# EAGLE schematic キッカー (EAGLE 9.6.2)

## Sheet 1 of 2
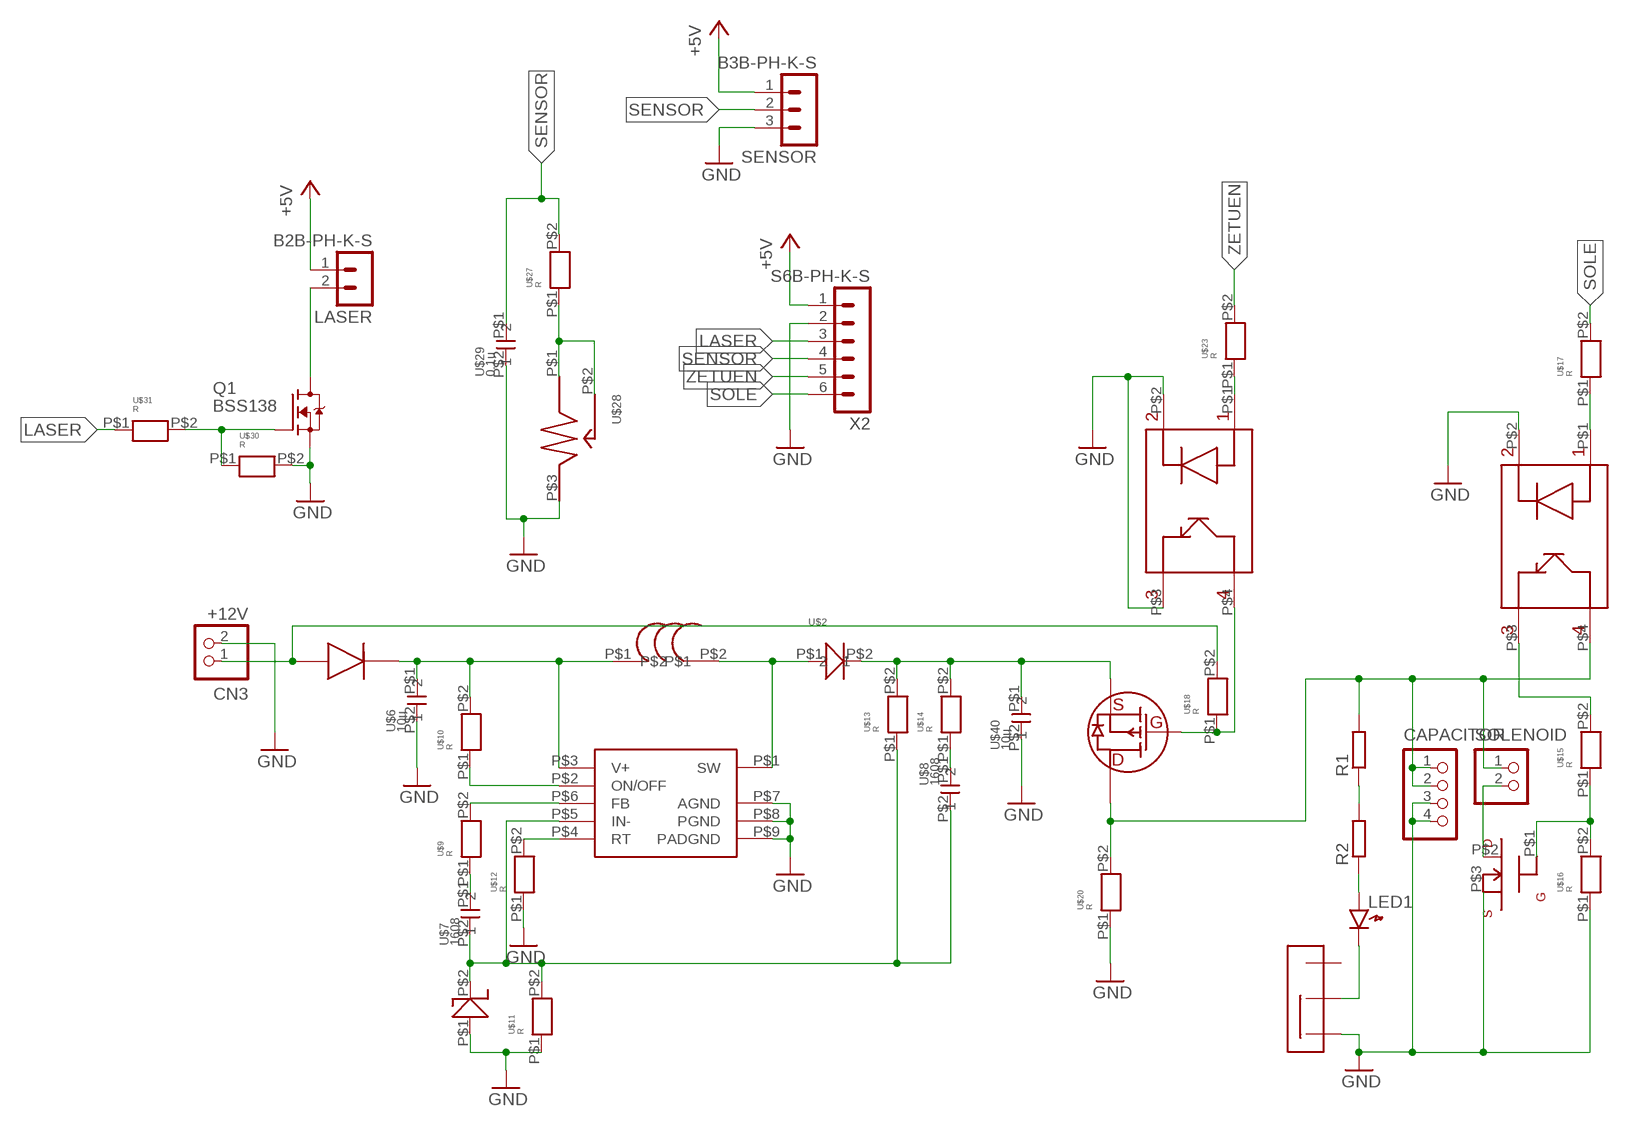
[diagram p0: schematic, sheet 1]

### Parts
CAPACITOR  B4B-XH-A  [B4B-XH-A]
CN3  +12V  B2B-XH-A  [B2B-XH-A]
LASER  B2B-PH-K-S  [B2B-PH-K-S]
LED1  LED1608  [LED1608]
Q1  BSS138  [SOT23]
R1  R-EU_0207/10  [0207/10]
R2  R-EU_0207/10  [0207/10]
SENSOR  B3B-PH-K-S  [B3B-PH-K-S]
SOLENOID  B2B-XH-A  [B2B-XH-A]
U$1  TD  [TD]
U$2  D  [D]
U$3  40V5A  [40V5A]
U$4  I  [I]
U$5  NJW4131GM1  [NJW4131]
U$6  10u  1608  [CON]
U$7  1608  [CON]
U$8  1608  [CON]
U$9  R  [1608]
U$10  R  [1608]
U$11  R  [1608]
U$12  R  [1608]
U$13  R  [1608]
U$14  R  [1608]
U$15  R  [1608]
U$16  R  [1608]
U$17  R  [1608]
U$18  R  [1608]
U$20  R  [1608]
U$21  MOS  [MOS]
U$22  PMOSPMOS  [PMOS]
U$23  R  [1608]
U$24  TLP291  [TPL291]
U$25  TLP291  [TPL291]
U$26  SSW  [SSW]
U$27  R  [1608]
U$28  VR  [VR]
U$29  0.1u  1608  [CON]
U$30  R  [1608]
U$31  R  [1608]
U$40  10u  1608  [CON]
X2  S6B-PH-K-S  [S6B-PH-K-S]

### Nets
+5V: LASER.1 SENSOR.1 X2.1
GND: CAPACITOR.3 CAPACITOR.4 CN3.2 Q1.2(S) SENSOR.3 U$1.P$1 U$5.P$7(AGND) U$5.P$8(PGND) U$5.P$9(PADGND) U$6.P$2 U$11.P$1 U$12.P$1 U$16.P$1 U$20.P$1 U$21.P$3 U$24.P$2 U$24.P$3 U$25.P$2 U$26.P$1 U$28.P$3 U$29.P$2 U$30.P$2 U$40.P$2 X2.2
LASER: U$31.P$1 X2.3
N$1: U$2.P$2 U$13.P$2 U$14.P$2 U$22.S U$40.P$1
N$2: U$5.P$2(ON/OFF) U$10.P$1
N$3: U$1.P$2 U$5.P$5(IN-) U$7.P$2 U$8.P$2 U$11.P$2 U$13.P$1
N$4: U$8.P$1 U$14.P$1
N$5: U$3.P$2 U$4.P$1 U$5.P$3(V+) U$6.P$1 U$10.P$2
N$6: U$2.P$1 U$4.P$2 U$5.P$1(SW)
N$7: U$5.P$6(FB) U$9.P$2
N$8: U$7.P$1 U$9.P$1
N$9: CN3.1 U$3.P$1 U$18.P$2
N$10: U$18.P$1 U$22.G U$24.P$4
N$11: U$5.P$4(RT) U$12.P$2
N$12: CAPACITOR.1 CAPACITOR.2 R1.2 SOLENOID.1 U$20.P$2 U$22.D U$25.P$4
N$13: U$15.P$2 U$25.P$3
N$14: U$23.P$1 U$24.P$1
N$15: LED1.K U$26.P$3
N$16: LED1.A R2.1
N$17: R1.1 R2.2
N$18: U$15.P$1 U$16.P$2 U$21.P$1
N$19: SOLENOID.2 U$21.P$2
N$20: U$17.P$1 U$25.P$1
N$21: LASER.2 Q1.3(D)
N$22: Q1.1(G) U$30.P$1 U$31.P$2
N$27: U$27.P$1 U$28.P$1 U$28.P$2
SENSOR: SENSOR.2 U$27.P$2 U$29.P$1 X2.4
SOLE: U$17.P$2 X2.6
ZETUEN: U$23.P$2 X2.5
Unconnected: U$26.P$2

## Sheet 2 of 2
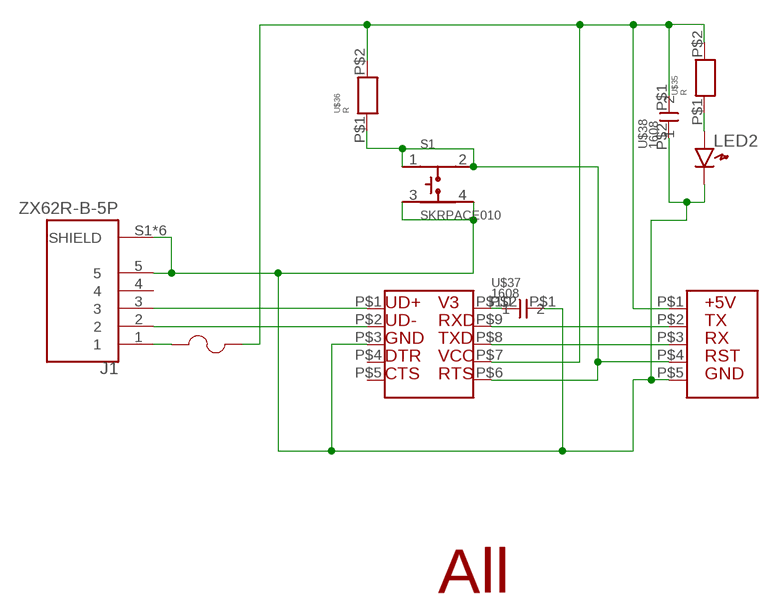
[diagram p1: schematic, sheet 2]

### Parts
J1  ZX62R-B-5P  [HRS_ZX62R-B-5P]
LED2  LED1608  [LED1608]
S1  SKRPACE010  [SW_SKRPACE010]
U$32  CH340K  [CH340K]
U$33  F  [F]
U$34  SI  [SI]
U$35  R  [1608]
U$36  R  [1608]
U$37  1608  [CON]
U$38  1608  [CON]
U$39  ALL  [ALL]

### Nets
1: S1.1 S1.2 U$32.P$6 U$34.P$4 U$36.P$1
N$23: J1.2 U$32.P$2
N$24: J1.3 U$32.P$1
N$25: J1.1 U$33.P$2
N$26: LED2.A U$35.P$1
N$28: U$32.P$8 U$34.P$3
N$29: U$32.P$9 U$34.P$2
N$30: U$32.P$10 U$37.P$2
N$31: J1.5 J1.S1(SHIELD) J1.S2(SHIELD) J1.S3(SHIELD) J1.S4(SHIELD) J1.S5(SHIELD) J1.S6(SHIELD) LED2.K S1.3 S1.4 U$32.P$3 U$34.P$5 U$37.P$1 U$38.P$2
N$32: U$32.P$7 U$33.P$1 U$34.P$1 U$35.P$2 U$36.P$2 U$38.P$1
Unconnected: J1.4 U$32.P$4 U$32.P$5

## Library data of the parts
CAPACITOR = jst-xh:B4B-XH-A: Wire-to-Board 2.5mm pitch top mount connector Source: http://www.jst-mfg.com/product/pdf/jpn/XH.pdf http://www.jst-mfg.com/product/detail.php?series=277
CN3 SOLENOID = jst-xh:B2B-XH-A: Wire-to-Board 2.5mm pitch top mount connector Source: http://www.jst-mfg.com/product/pdf/jpn/XH.pdf http://www.jst-mfg.com/product/detail.php?series=277
J1 = USBMicro:ZX62R-B-5P: Conn Micro USB 2.0 Type B RCP 5 POS 0.65mm Solder RA SMD 5 Terminal 1 Port Embossed T/R Check prices <https://pricing.snapeda.com/parts/ZX62R-B-5P/Hirose/view-part?ref=eda>; AVAILABILITY: In Stock; DESCRIPTION: USB - micro B USB 2.0 Receptacle Connector 5 Position Surface Mount, Right Angle; MF: Hirose; MP: ZX62R-B-5P; PACKAGE: None; PRICE: None
LASER = con-JST PH:B2B-PH: JST PH series header 2.00mm pitch disconnectable crimp style connectors, vertical (side entry type), 2 pins
LED1 LED2 = generic:LED: Generic LEDs
Q1 = bss138_10:BSS138: BSS138 N-Channel Logic Level Enhancement Mode Field Effect Transistor Source: http://www.fairchildsemi.com/datasheets/BS/BSS138.pdf; MF: Fairchild; MPN: BSS138; OC_FARNELL: 9845330; OC_NEWARK: 67R2009
R1 R2 = rcl:R-EU_: RESISTOR, European symbol; SPICEPREFIX: R
S1 = SKRPACE010:SKRPACE010: Switch Tactile N.O. SPST Button J-Bend 0.05A 16VDC 2.55N SMD Automotive T/R Check prices <https://pricing.snapeda.com/parts/SKRPACE010/ALPS/view-part?ref=eda>; AVAILABILITY: In Stock; DESCRIPTION: Switch Tactile N.O. SPST Button J-Bend 0.05A 16VDC 2.55N SMD Automotive T/R; MF: ALPS; MP: SKRPACE010; PACKAGE: None; PRICE: None
SENSOR = con-JST PH:B3B-PH: JST PH series header 2.00mm pitch disconnectable crimp style connectors, vertical (side entry type), 3 pins
U$1 = ZD 3.9V200mW:TD
U$2 = D 40V2A:D
U$3 = D40V5A:40V5A
U$4 = Inductor_Read:I
U$5 = NJW4131GM1:NJW4131GM1
U$6-U$8 U$29 U$37 U$38 U$40 = con1608:1608
U$9-U$18 U$20 U$23 U$27 U$30 U$31 U$35 U$36 = R 1608:R
U$21 = MOS-FET:MOS
U$22 = PchMOSFET 60V16.7A:PMOS
U$24 U$25 = TLP291:TLP291
U$26 = SSW:SSW
U$28 = VR tippu:VR
U$32 = CH340K:CH340K
U$33 = F:F
U$34 = プログラム入力:SI
U$39 = All_outlook:ALL
X2 = con-JST PH:S6B-PH: JST PH series header 2.00mm pitch disconnectable crimp style connectors, horizontal (side entry type), 6 pins